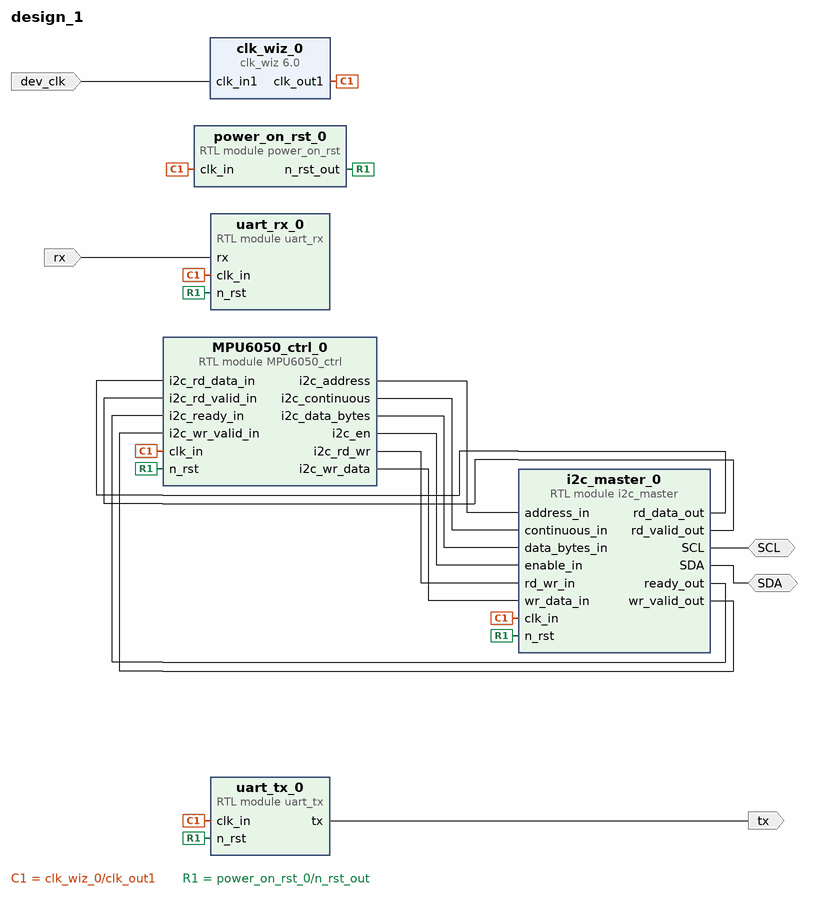
[diagram p0: block diagram of the top level]
# Vivado block design design_1, xc7a50tfgg484-1, Vivado 2023.2
create_bd_design design_1

create_bd_port -dir I -type clk dev_clk
set_property -dict {CONFIG.FREQ_HZ 25000000} [get_bd_ports dev_clk]
create_bd_port -dir IO SCL
create_bd_port -dir IO SDA
create_bd_port -dir I rx
create_bd_port -dir O tx

create_bd_cell -type module -reference MPU6050_ctrl MPU6050_ctrl_0
create_bd_cell -type module -reference i2c_master i2c_master_0
set_property -dict {CONFIG.CLK_IN_FREQ_MHZ 96 CONFIG.SCL_FREQ_KHZ 96} [get_bd_cells i2c_master_0]
create_bd_cell -type module -reference power_on_rst power_on_rst_0
create_bd_cell -type module -reference uart_rx uart_rx_0
set_property -dict {CONFIG.OVERSAMPLING 10000} [get_bd_cells uart_rx_0]
create_bd_cell -type module -reference uart_tx uart_tx_0
set_property -dict {CONFIG.OVERSAMPLING 10000} [get_bd_cells uart_tx_0]
create_bd_cell -type ip -vlnv xilinx.com:ip:clk_wiz:6.0 clk_wiz_0
set_property -dict [list \
  CONFIG.CLKIN1_JITTER_PS 400.0 \
  CONFIG.CLKOUT1_DRIVES BUFG \
  CONFIG.CLKOUT1_JITTER 254.806 \
  CONFIG.CLKOUT1_PHASE_ERROR 249.865 \
  CONFIG.CLKOUT1_REQUESTED_OUT_FREQ 96.000 \
  CONFIG.CLKOUT2_DRIVES BUFG \
  CONFIG.CLKOUT3_DRIVES BUFG \
  CONFIG.CLKOUT4_DRIVES BUFG \
  CONFIG.CLKOUT5_DRIVES BUFG \
  CONFIG.CLKOUT6_DRIVES BUFG \
  CONFIG.CLKOUT7_DRIVES BUFG \
  CONFIG.FEEDBACK_SOURCE FDBK_AUTO \
  CONFIG.MMCM_BANDWIDTH OPTIMIZED \
  CONFIG.MMCM_CLKFBOUT_MULT_F 36.000 \
  CONFIG.MMCM_CLKIN1_PERIOD 40.000 \
  CONFIG.MMCM_CLKIN2_PERIOD 10.0 \
  CONFIG.MMCM_CLKOUT0_DIVIDE_F 9.375 \
  CONFIG.MMCM_COMPENSATION ZHOLD \
  CONFIG.PRIMITIVE MMCM \
  CONFIG.PRIM_IN_FREQ 25.000 \
  CONFIG.PRIM_SOURCE Single_ended_clock_capable_pin \
  CONFIG.SECONDARY_SOURCE Single_ended_clock_capable_pin \
  CONFIG.USE_LOCKED false \
  CONFIG.USE_PHASE_ALIGNMENT true \
  CONFIG.USE_RESET false \
] [get_bd_cells clk_wiz_0]

# ---- connections ----

connect_bd_net [get_bd_pins MPU6050_ctrl_0/i2c_address] [get_bd_pins i2c_master_0/address_in]
connect_bd_net [get_bd_pins MPU6050_ctrl_0/i2c_continuous] [get_bd_pins i2c_master_0/continuous_in]
connect_bd_net [get_bd_pins MPU6050_ctrl_0/i2c_data_bytes] [get_bd_pins i2c_master_0/data_bytes_in]
connect_bd_net [get_bd_pins MPU6050_ctrl_0/i2c_en] [get_bd_pins i2c_master_0/enable_in]
connect_bd_net [get_bd_pins MPU6050_ctrl_0/i2c_rd_wr] [get_bd_pins i2c_master_0/rd_wr_in]
connect_bd_net [get_bd_pins MPU6050_ctrl_0/i2c_wr_data] [get_bd_pins i2c_master_0/wr_data_in]
connect_bd_net [get_bd_ports SCL] [get_bd_pins i2c_master_0/SCL]
connect_bd_net [get_bd_ports SDA] [get_bd_pins i2c_master_0/SDA]
connect_bd_net [get_bd_pins clk_wiz_0/clk_out1] \
  [get_bd_pins MPU6050_ctrl_0/clk_in] [get_bd_pins uart_rx_0/clk_in] [get_bd_pins uart_tx_0/clk_in] \
  [get_bd_pins i2c_master_0/clk_in] [get_bd_pins power_on_rst_0/clk_in]
connect_bd_net [get_bd_ports dev_clk] [get_bd_pins clk_wiz_0/clk_in1]
connect_bd_net [get_bd_pins i2c_master_0/rd_data_out] [get_bd_pins MPU6050_ctrl_0/i2c_rd_data_in]
connect_bd_net [get_bd_pins i2c_master_0/rd_valid_out] [get_bd_pins MPU6050_ctrl_0/i2c_rd_valid_in]
connect_bd_net [get_bd_pins i2c_master_0/ready_out] [get_bd_pins MPU6050_ctrl_0/i2c_ready_in]
connect_bd_net [get_bd_pins i2c_master_0/wr_valid_out] [get_bd_pins MPU6050_ctrl_0/i2c_wr_valid_in]
connect_bd_net [get_bd_pins power_on_rst_0/n_rst_out] \
  [get_bd_pins uart_rx_0/n_rst] [get_bd_pins uart_tx_0/n_rst] [get_bd_pins MPU6050_ctrl_0/n_rst] \
  [get_bd_pins i2c_master_0/n_rst]
connect_bd_net [get_bd_ports rx] [get_bd_pins uart_rx_0/rx]
connect_bd_net [get_bd_pins uart_tx_0/tx] [get_bd_ports tx]

validate_bd_design
save_bd_design
